# EAGLE schematic full_motor (EAGLE 7.5.0)
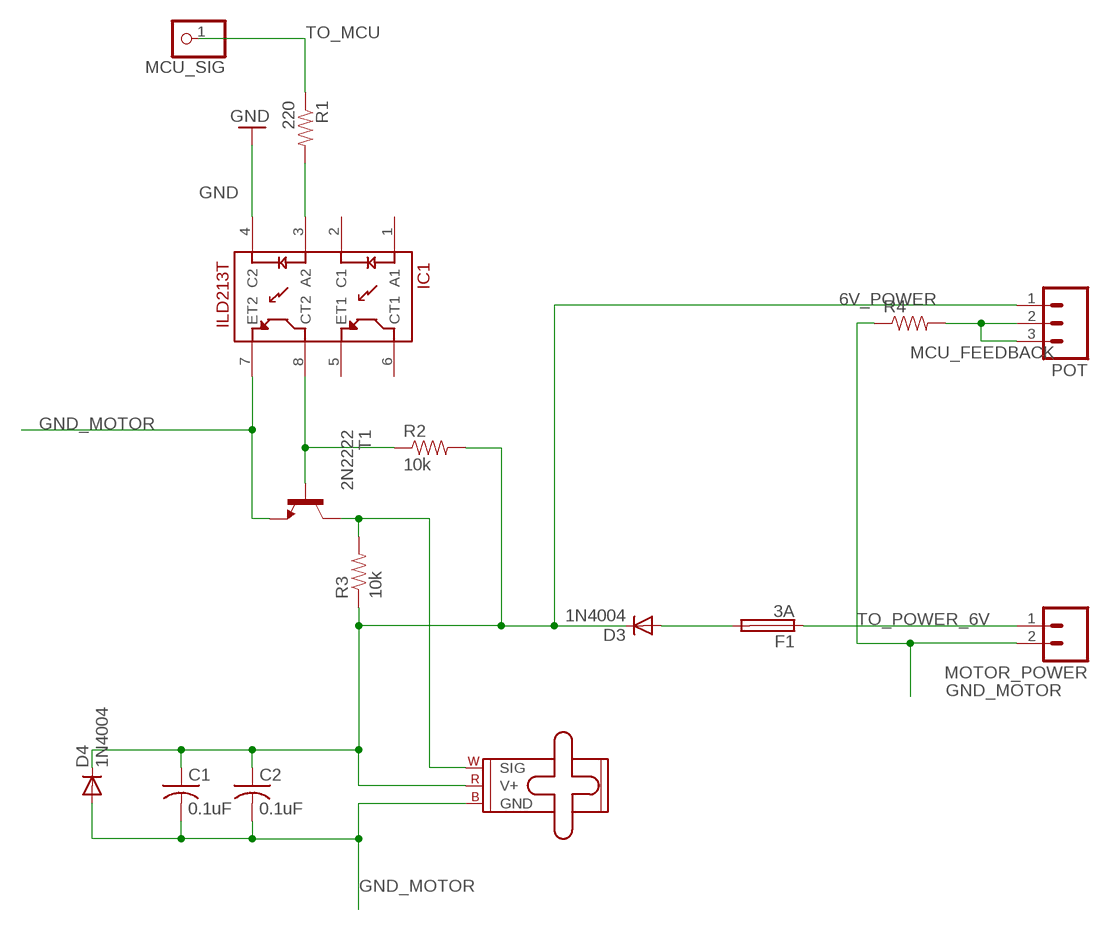
[diagram p0: schematic, sheet 1]

## Parts
C1  0.1uF  C-US025-024X044  [C025-024X044]
C2  0.1uF  C-US025-024X044  [C025-024X044]
D3  1N4004  [DO41-10]
D4  1N4004  [DO41-10]
F1  3A  TE5  [TE5]
IC1  ILD213T  [SO08]
MCU_SIG  PINHD-1X1  [1X01]
MOTOR_POWER  M02PTH  [1X02]
POT  M03PTH  [1X03]
R1  220  RESISTOREZ  [AXIAL-0.3EZ]
R2  10k  RESISTOREZ  [AXIAL-0.3EZ]
R3  10k  RESISTOREZ  [AXIAL-0.3EZ]
R4  RESISTOREZ  [AXIAL-0.3EZ]
SERVO  SMALL_SERVO  [1X03]
T1  2N2222  [TO92-EBC-OVAL]

## Nets
6V_POWER: C1.1 C2.1 D3.C D4.C POT.1 R2.P$2 R3.P$1 SERVO.2(V+)
GND: IC1.4(C2)
GND_MOTOR: C1.2 C2.2 D4.A IC1.7(ET2) MOTOR_POWER.2 R4.P$1 SERVO.3(GND) T1.E
MCU_FEEDBACK: POT.2 POT.3 R4.P$2
N$1: IC1.3(A2) R1.P$2
N$3: IC1.8(CT2) R2.P$1 T1.B
N$4: D3.A F1.2
N$6: R3.P$2 SERVO.1(SIG) T1.C
TO_MCU: MCU_SIG.1 R1.P$1
TO_POWER_6V: F1.1 MOTOR_POWER.1
Unconnected: IC1.1(A1) IC1.2(C1) IC1.5(ET1) IC1.6(CT1)

## Library data of the parts
C1 C2 = adafruit:C-US: CAPACITOR, American symbol
D3 D4 = adafruit:1N4004: DIODE General purpose 1N400x type rectifier (With bigger pads) http://www.ladyada.net/library/pcb/eaglelibrary.html
F1 = fuse:TE5: FUSE Wickmann; OC_FARNELL: unknown; OC_NEWARK: unknown
IC1 = SparkFun-DiscreteSemi:ILD213T: Dual optoisolator.
MCU_SIG = pinhead:PINHD-1X1: PIN HEADER
MOTOR_POWER = SparkFun-Connectors:M02: Standard 2-pin 0.1" header. Use with - straight break away headers ( PRT-00116) - right angle break away headers (PRT-00553) - swiss pins (PRT-00743) - machine pins (PRT-00117) - female headers (PRT-00115) Molex polarized connector foot print use with: PRT-08233 with associated crimp pins and housings. 2.54_SCREWTERM for use with PRT-10571. 3.5mm Screw Terminal footprints for PRT-08084 5mm Screw Terminal footprints for use with PRT-08432
POT = SparkFun-Connectors:M03: Header 3 Standard 3-pin 0.1" header. Use with straight break away headers (SKU : PRT-00116), right angle break away headers (PRT-00553), swiss pins (PRT-00743), machine pins (PRT-00117), and female headers (PRT-00115). Molex polarized connector foot print use with SKU : PRT-08232 with associated crimp pins and housings.
R1-R4 = SparkFun-Passives:RESISTOR: Resistor Basic schematic elements and footprints for 0603, 1206, and PTH resistors.
SERVO = SparkFun-Electromechanical:SMALL_SERVO: Small servo motor This is the small servo used in the SIK. SKU: ROB-09065
T1 = adafruit:2N2222: NPN TRANSISTOR Big oval pads